# Altium schematic sheet TXPAFV2.SchDoc
size A4; SheetNumber: 1; SheetTotal: 1
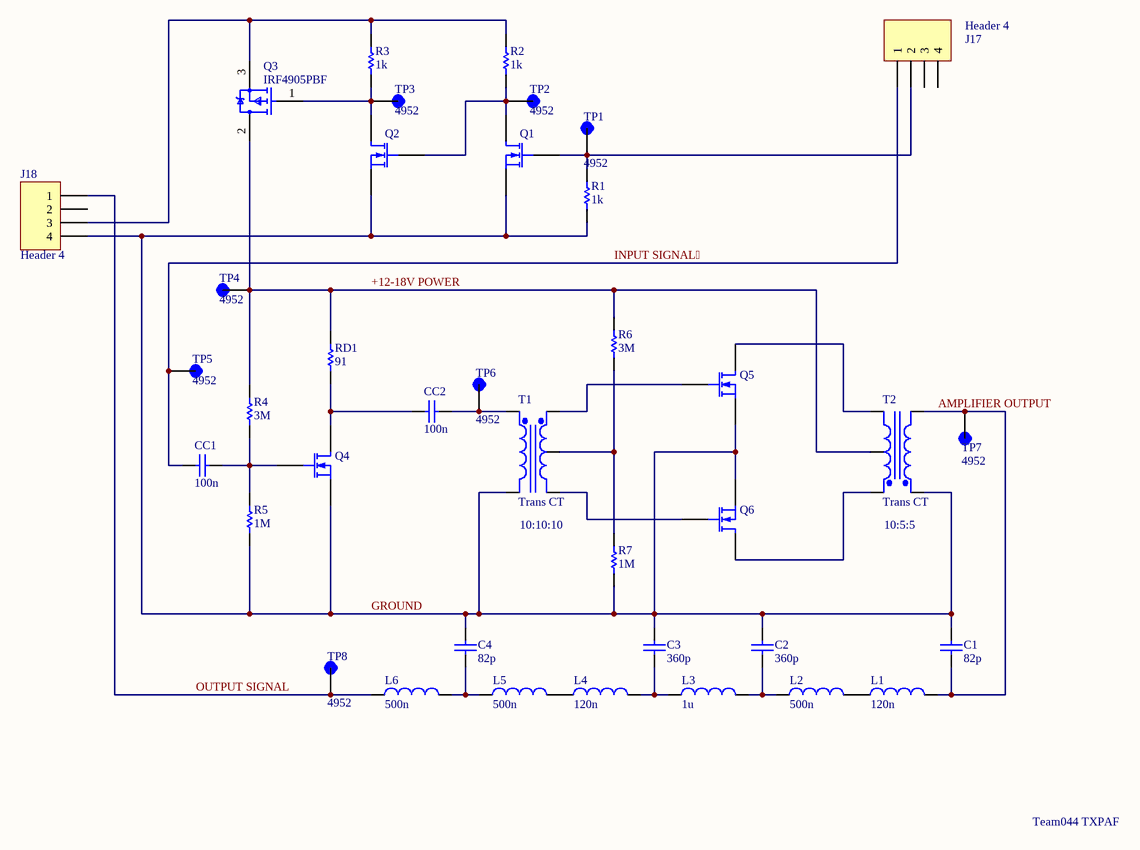
[diagram p0: TXPAFV2.SchDoc]

## Parts
C1  value 82p  [K820J15C0GF5TL2]  (hidden comment: Capacitor)
C2  value 360p  [C322C361J5G5TA]  (hidden comment: Capacitor)
C3  value 360p  [C322C361J5G5TA]  (hidden comment: Capacitor)
C4  value 82p  [K820J15C0GF5TL2]  (hidden comment: Capacitor)
CC1  value 100n  [K104K15X7RF5TL2]  (hidden comment: Capacitor)
CC2  value 100n  [K104K15X7RF5TL2]  (hidden comment: Capacitor)
J17  Header 4  [HDR1X4]
J18  Header 4  [HDR1X4]
L1  value 120n  [9230-96-RC]  (hidden comment: Inductor)
L2  value 500n  [78432010005]  (hidden comment: Inductor)
L3  value 1u  [9250A-102-RC]  (hidden comment: Inductor)
L4  value 120n  [9230-96-RC]  (hidden comment: Inductor)
L5  value 500n  [78432010005]  (hidden comment: Inductor)
L6  value 500n  [78432010005]  (hidden comment: Inductor)
Q1  N-chanel Power MOSFET VDMOS Model  [BS170]  (value not drawn)
Q2  N-chanel Power MOSFET VDMOS Model  [BS170]  (value not drawn)
Q3  IRF4905PBF  [FP-PG-TO220-3-MFG]
Q4  N-chanel Power MOSFET VDMOS Model  [BS170]  (value not drawn)
Q5  N-chanel Power MOSFET VDMOS Model  [BS170]  (value not drawn)
Q6  N-chanel Power MOSFET VDMOS Model  [BS170]  (value not drawn)
R1  value 1k  [CF14JT1K00]  (hidden comment: Resistor)
R2  value 1k  [CF14JT1K00]  (hidden comment: Resistor)
R3  value 1k  [CF14JT1K00]  (hidden comment: Resistor)
R4  value 3M  [HVR3700003004FR500]  (hidden comment: Resistor)
R5  value 1M  [MBB0207VD1004BC100]  (hidden comment: Resistor)
R6  value 3M  [HVR3700003004FR500]  (hidden comment: Resistor)
R7  value 1M  [MBB0207VD1004BC100]  (hidden comment: Resistor)
RD1  value 91  [RR02J91RTB]  (hidden comment: Resistor)
T1  Trans CT  [CT-Transformer]
T2  Trans CT  [CT-Transformer]
TP1  4952  [4952]
TP2  4952  [4952]
TP3  4952  [4952]
TP4  4952  [4952]
TP5  4952  [4952]
TP6  4952  [4952]
TP7  4952  [4952]
TP8  4952  [4952]

## Nets
+12-18V POWER: Q3.2(DRAIN) R4.2 R6.2 RD1.1 T2.2(SecCT) TP4.TP
AMPLIFIER OUTPUT: C1.1 L1.2 T2.5(Pri-) TP7.TP
GROUND: C1.2 C2.2 C3.2 C4.2 J18.4 Q1.3(S) Q2.3(S) Q4.3(S) Q5.3(S) Q6.3(S) R1.1 R5.1 R7.1 T1.5(Pri-) T2.4(Pri+)
INPUT SIGNAL: CC1.2 J17.1 TP5.TP
OUTPUT SIGNAL: J18.1 L6.1 TP8.TP
NetC2_1: C2.1 L2.1 L3.2
NetC3_1: C3.1 L3.1 L4.2
NetC4_1: C4.1 L5.1 L6.2
NetCC1_1: CC1.1 Q4.2(G) R4.1 R5.2
NetCC2_1: CC2.1 T1.4(Pri+) TP6.TP
NetCC2_2: CC2.2 Q4.1(D) RD1.2
NetJ17_2: J17.2 Q1.2(G) R1.2 TP1.TP
NetJ18_3: J18.3 Q3.3(SOURCE) R2.2 R3.2
NetL1_1: L1.1 L2.2
NetL4_1: L4.1 L5.2
NetQ1_1: Q1.1(D) Q2.2(G) R2.1 TP2.TP
NetQ2_1: Q2.1(D) Q3.1(GATE) R3.1 TP3.TP
NetQ5_1: Q5.1(D) T2.3(Sec-)
NetQ5_2: Q5.2(G) T1.1(Sec+)
NetQ6_1: Q6.1(D) T2.1(Sec+)
NetQ6_2: Q6.2(G) T1.3(Sec-)
NetR6_1: R6.1 R7.2 T1.2(SecCT)

Not connected (* = marked no-connect by the designer): J17 3 4; J18 2

## Notes on the sheet
- (near T1) 10:10:10
- (near T2) 10:5:5
- Team044 TXPAF

## Library data of the parts
C1-C4 CC1 CC2 = Capacitor: SimulationGenericComponent: True
J17 J18 = Header 4: Header, 4-Pin; LatestRevisionDate: 17-Jul-2002; LatestRevisionNote: Re-released for DXP Platform.; Publisher: Altium Limited
L1-L6 = Inductor: SimulationGenericComponent: True
Q1 Q2 Q4-Q6 = MOSFET N-ch VDMOS: XTI: 0; A: 1; BV: 1e30; EG: 1.11; FC: 0.5; IBV: 1e-10; IS: 1e-14; PHI: 0.6; TNOM: 27; VJ: 0.8; SimulationGenericComponent: True; CGDMAX: 0; CGDMIN: 0; CGS: 0; CJO: 0; KP: 1; KSUBTHRES: 0; LAMBDA: 0; M: 0.5; MTRIODE: 1; N: 1; NBV: 1; NCHAN: 1; RB: 0; RD: 0; RDS: 1e30; RG: 0; RQ: 0; RS: 0; SUBSHIFT: 0; SUBSLOPE: 0; THETA: 0; TT: 0; VQ: 0; VTO: 0
Q3 = CMP-32901-000200-1: MOSFET P-CH 55V 74A TO-220AB; Drain to Source Resistance: 20mR; Input Capacitance: 3.4nF; Max Dual Supply Voltage: -55V; Power Dissipation: 200W; Turn-On Delay Time: 18ns; Element Configuration: Single; Threshold Voltage: -4V; Gate to Source Voltage (Vgs): 20V; Turn-Off Delay Time: 61ns; Number of Pins: 3; Packaging: Rail/Tube; RoHS Compliant: Yes; REACH SVHC: No SVHC; Halogen Free: Halogen Free; Max Power Dissipation: 200W; Drain to Source Breakdown Voltage: -55V; Length: 0.414inch; Drain to Source Voltage (Vdss): -55V; Height: 0.6inch; Case/Package: TO-220; Width: 0.185inch; Continuous Drain Current (ID): 74A; Mount: Through Hole; Min Operating Temperature: -55°C; Lead Free: Lead Free; Max Operating Temperature: 175°C; Rds On Max: 20mR
R1-R7 RD1 = Resistor: TC1: 0; SimulationGenericComponent: True; TC2: 0
T1 T2 = Centre-tapped transformer wound on a binocular core: Center-Tapped Transformer (Coupled Inductor Model); Designator: T?; Published: 8-Jun-2000; LatestRevisionDate: 17-Jul-2002; LatestRevisionNote: Re-released for DXP Platform.; Publisher: Altium Limited
TP1-TP8 = 4952: Price: None; Availability: Unavailable; Package: None; Value: *; MP: 4952